# EAGLE design ULA (EAGLE 7.4.0)
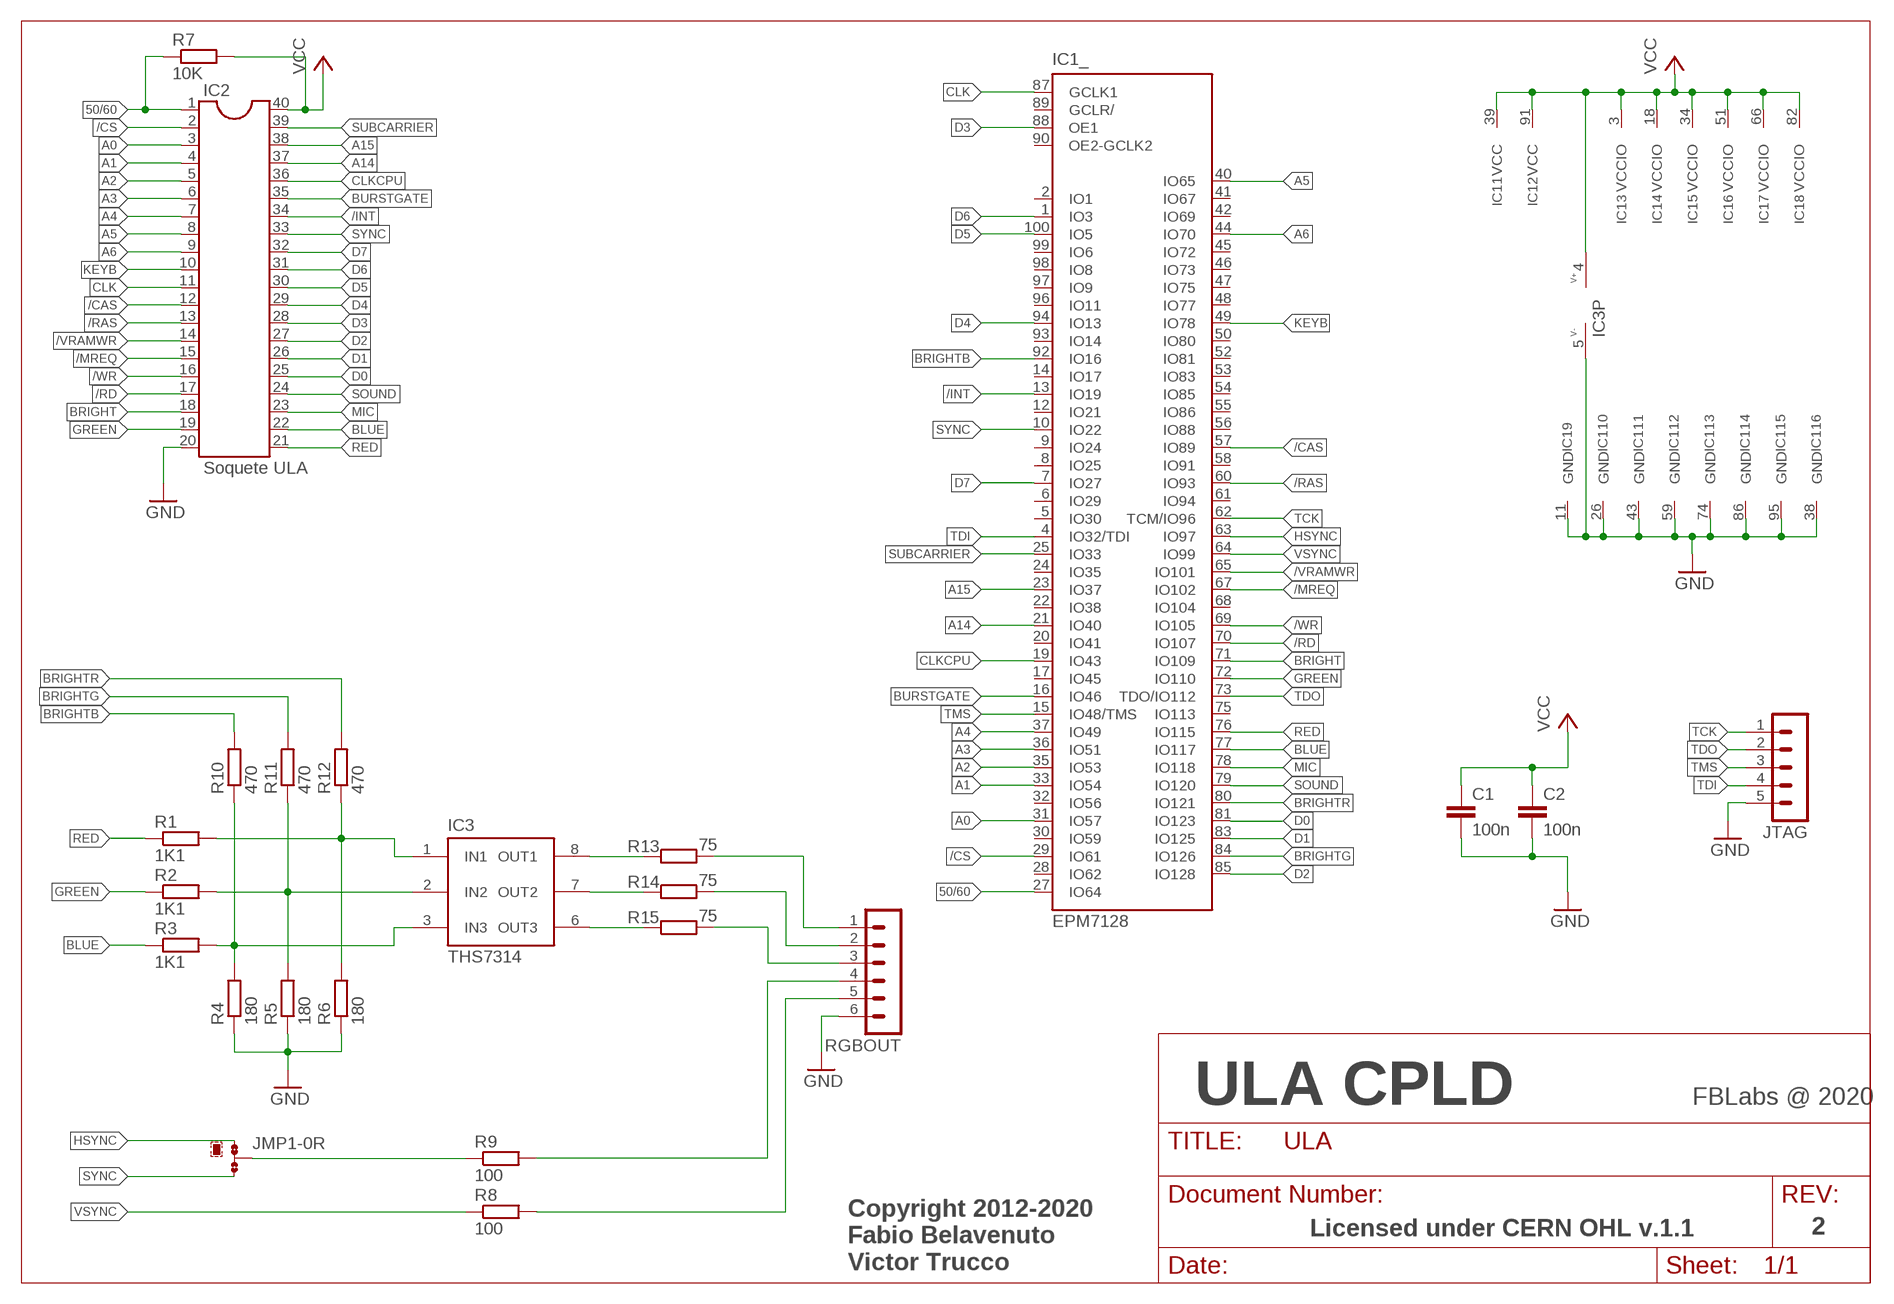
[diagram p0: schematic, sheet 1]

## Parts
C1  100n  C-EUC1206  [C1206]
C2  100n  C-EUC1206  [C1206]
IC1  EPM7128  EPM7128-T100  [TQFP100]
IC2  Soquete ULA  DIL40  [DIL40]
IC3  THS7314  [SOIC8]
JMP1  0R-JUMPA  [A0R-JMP]
JTAG  MA05-1  [MA05-1]
R1  1K1  R-EU_M0805  [M0805]
R2  1K1  R-EU_M0805  [M0805]
R3  1K1  R-EU_M0805  [M0805]
R4  180  R-EU_M0805  [M0805]
R5  180  R-EU_M0805  [M0805]
R6  180  R-EU_M0805  [M0805]
R7  10K  R-EU_M0805  [M0805]
R8  100  R-EU_M0805  [M0805]
R9  100  R-EU_M0805  [M0805]
R10  470  R-EU_M0805  [M0805]
R11  470  R-EU_M0805  [M0805]
R12  470  R-EU_M0805  [M0805]
R13  75  R-EU_M0805  [M0805]
R14  75  R-EU_M0805  [M0805]
R15  75  R-EU_M0805  [M0805]
RGBOUT  MA06-1  [MA06-1]

## Nets
50/60: IC1.27(_:IO64) IC2.1 R7.1
/CAS: IC1.57(_:IO89) IC2.12
/CS: IC1.29(_:IO61) IC2.2
/INT: IC1.13(_:IO19) IC2.34
/MREQ: IC1.67(_:IO102) IC2.15
/RAS: IC1.60(_:IO93) IC2.13
/RD: IC1.70(_:IO107) IC2.17
/VRAMWR: IC1.65(_:IO101) IC2.14
/WR: IC1.69(_:IO105) IC2.16
A0: IC1.31(_:IO57) IC2.3
A1: IC1.33(_:IO54) IC2.4
A2: IC1.35(_:IO53) IC2.5
A3: IC1.36(_:IO51) IC2.6
A4: IC1.37(_:IO49) IC2.7
A5: IC1.40(_:IO65) IC2.8
A6: IC1.44(_:IO70) IC2.9
A14: IC1.21(_:IO40) IC2.37
A15: IC1.23(_:IO37) IC2.38
BLUE: IC1.77(_:IO117) IC2.22 R3.1
BRIGHT: IC1.71(_:IO109) IC2.18
BRIGHTB: IC1.92(_:IO16) R10.2
BRIGHTG: IC1.84(_:IO126) R11.2
BRIGHTR: IC1.80(_:IO121) R12.2
BURSTGATE: IC1.16(_:IO46) IC2.35
CLK: IC1.87(_:GCLK1) IC2.11
CLKCPU: IC1.19(_:IO43) IC2.36
D0: IC1.81(_:IO123) IC2.25
D1: IC1.83(_:IO125) IC2.26
D2: IC1.85(_:IO128) IC2.27
D3: IC1.88(_:OE1) IC2.28
D4: IC1.94(_:IO13) IC2.29
D5: IC1.100(_:IO5) IC2.30
D6: IC1.1(_:IO3) IC2.31
D7: IC1.7(_:IO27) IC2.32
GND [Power]: C1.2 C2.2 IC1.11(9:GND) IC1.26(10:GND) IC1.38(16:GND) IC1.43(11:GND) IC1.59(12:GND) IC1.74(13:GND) IC1.86(14:GND) IC1.95(15:GND) IC2.20 IC3.5(V-) JTAG.5 R4.1 R5.1 R6.1 RGBOUT.6
GREEN: IC1.72(_:IO110) IC2.19 R2.1
HSYNC: IC1.63(_:IO97) JMP1.1
KEYB: IC1.49(_:IO78) IC2.10
MIC: IC1.78(_:IO118) IC2.23
N$1: R15.2 RGBOUT.3
N$2: R14.2 RGBOUT.2
N$3: R13.2 RGBOUT.1
N$4: IC3.3(IN3) R3.2 R4.2 R10.1
N$5: IC3.2(IN2) R2.2 R5.2 R11.1
N$6: IC3.6(OUT3) R15.1
N$7: IC3.7(OUT2) R14.1
N$8: IC3.8(OUT1) R13.1
N$10: IC3.1(IN1) R1.2 R6.2 R12.1
N$12: JMP1.2 R9.1
N$13: R9.2 RGBOUT.4
N$14: R8.2 RGBOUT.5
RED: IC1.76(_:IO115) IC2.21 R1.1
SOUND: IC1.79(_:IO120) IC2.24
SUBCARRIER: IC1.25(_:IO33) IC2.39
SYNC: IC1.10(_:IO22) IC2.33 JMP1.3
TCK: IC1.62(_:TCM/IO96) JTAG.1
TDI: IC1.4(_:IO32/TDI) JTAG.4
TDO: IC1.73(_:TDO/IO112) JTAG.2
TMS: IC1.15(_:IO48/TMS) JTAG.3
VCC [Power]: C1.1 C2.1 IC1.3(3:VCCIO) IC1.18(4:VCCIO) IC1.34(5:VCCIO) IC1.39(1:VCC) IC1.51(6:VCCIO) IC1.66(7:VCCIO) IC1.82(8:VCCIO) IC1.91(2:VCC) IC2.40 IC3.4(V+) R7.2
VSYNC: IC1.64(_:IO99) R8.1
Unconnected: IC1.2(_:IO1) IC1.5(_:IO30) IC1.6(_:IO29) IC1.8(_:IO25) IC1.9(_:IO24) IC1.12(_:IO21) IC1.14(_:IO17) IC1.17(_:IO45) IC1.20(_:IO41) IC1.22(_:IO38) IC1.24(_:IO35) IC1.28(_:IO62) IC1.30(_:IO59) IC1.32(_:IO56) IC1.41(_:IO67) IC1.42(_:IO69) IC1.45(_:IO72) IC1.46(_:IO73) IC1.47(_:IO75) IC1.48(_:IO77) IC1.50(_:IO80) IC1.52(_:IO81) IC1.53(_:IO83) IC1.54(_:IO85) IC1.55(_:IO86) IC1.56(_:IO88) IC1.58(_:IO91) IC1.61(_:IO94) IC1.68(_:IO104) IC1.75(_:IO113) IC1.89(_:GCLR/) IC1.90(_:OE2-GCLK2) IC1.93(_:IO14) IC1.96(_:IO11) IC1.97(_:IO9) IC1.98(_:IO8) IC1.99(_:IO6)

## Notes on the sheet
- ULA CPLD | FBLabs @ 2020
- Licensed under CERN OHL v.1.1 | 2
- Copyright 2012-2020
  Fabio Belavenuto
  Victor Trucco

## Library data of the parts
C1 C2 = rcl:C-EU: CAPACITOR, European symbol
IC1 = altera2:EPM7128-?100: EPM70128 MAX 7000 family; MPN: EPM7128STC100-7N; OC_FARNELL: 1549427; OC_NEWARK: 51R9778
IC2 = ULA_libs:DIL40: Dual In Line
IC3 = Texas2:THS7314: THS7314DR Video Buffer
JMP1 = jump-0r-smd:0R-JUMP: SMD 0R 0805 Jumper
JTAG = ULA_libs:MA05-1: PIN HEADER
R1-R15 = rcl:R-EU_: RESISTOR, European symbol
RGBOUT = ULA_libs:MA06-1: PIN HEADER

## Net classes
0 default: width 0.152 mm, drill 0.483 mm, clearance 0.152 mm
1 Power: width 0.203 mm, drill 0.584 mm, clearance 0.203 mm

## Board
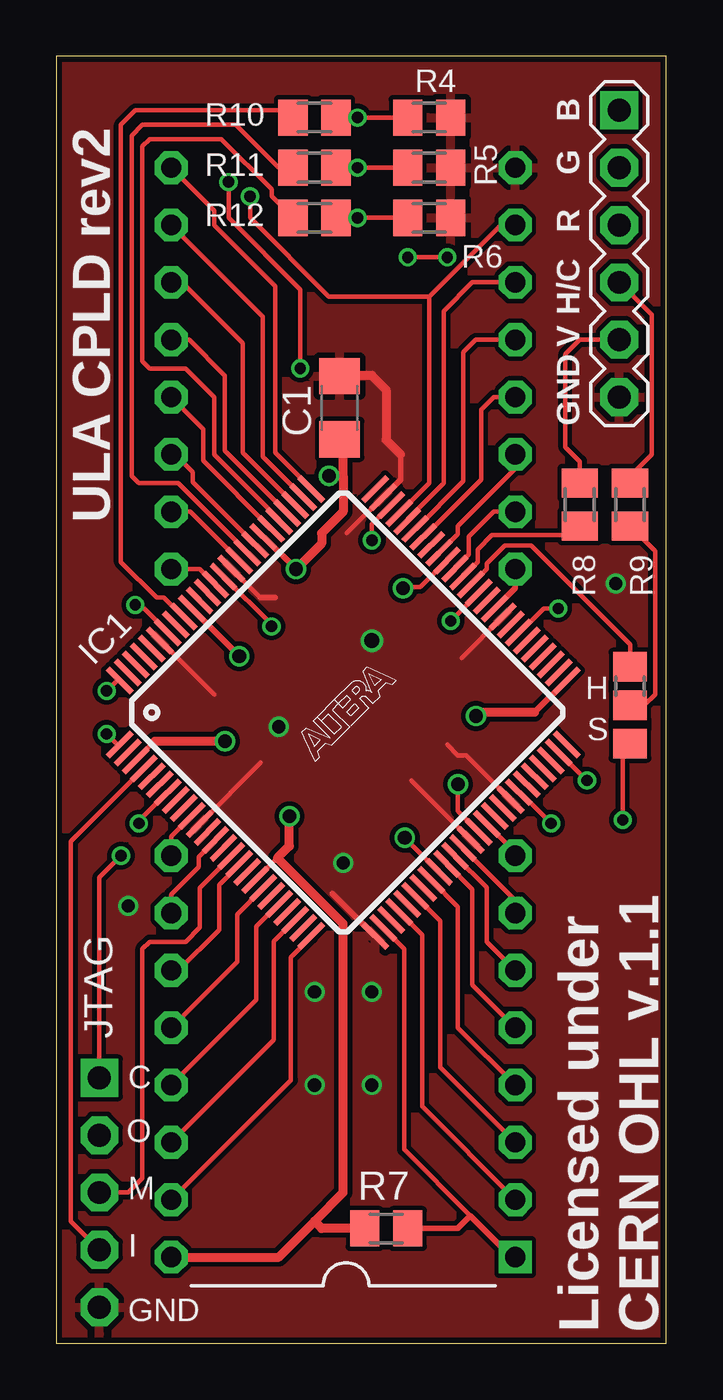
[diagram p1: board, top side]
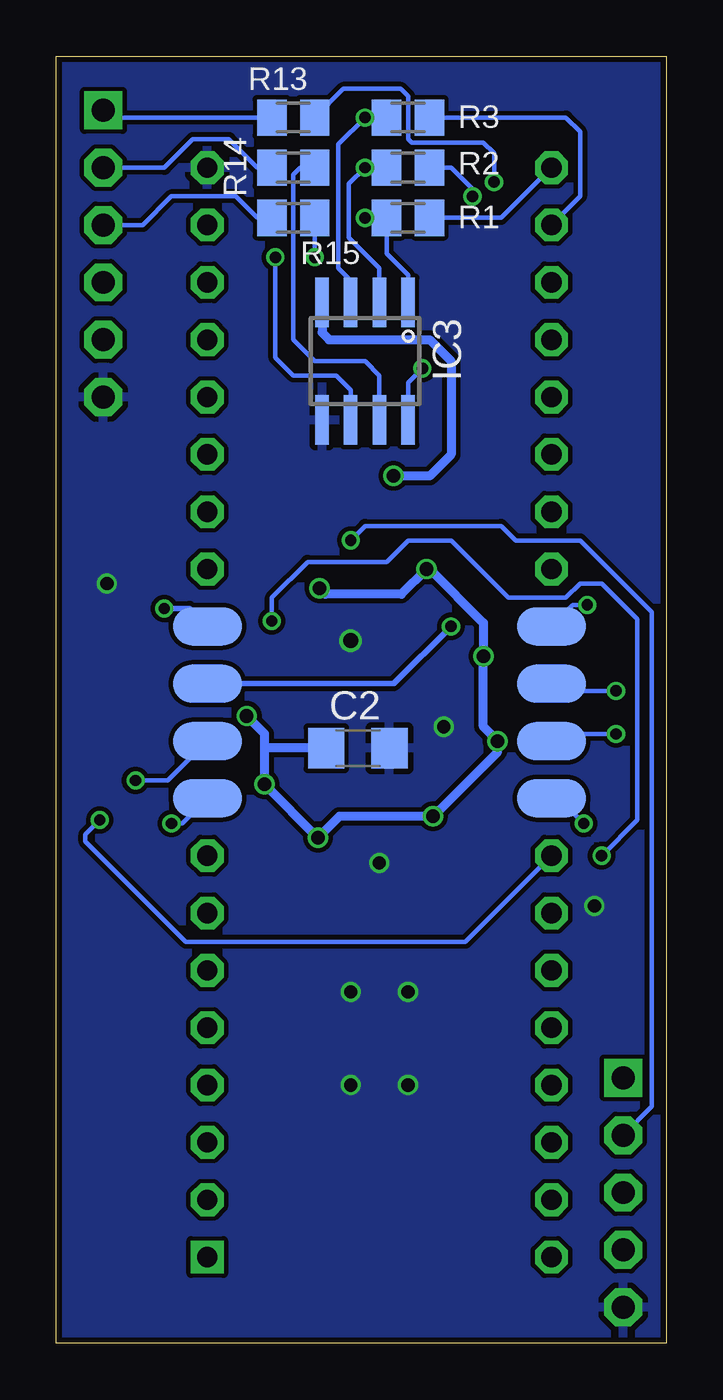
[diagram p2: board, bottom side, seen from below]

Size 27 x 57 mm. Coordinates in mm from the lower left corner, seen from the top.
Outline: 0,0 27,0 27,57 0,57 0,0
Copper layers (1*16): Top 0.035mm / dielectric 1.5mm / Bottom 0.035mm
Design rules "Seedstudio(6mil) *": minimum track width 6mil, minimum drill 12mil, track to track 6mil, track to pad 6mil, pad to pad 6mil, via to via 6mil, smd to smd 0mil, copper to edge 10mil, drill to drill 10mil, minimum pad ring 10mil, minimum via ring 6mil, stop-mask expansion 2mil, vias tented up to drill 100mil, thermal gap 10mil

### Footprints (pad centres in the part's own frame; a part is rotated, then mirrored left to right if it is on the bottom)
C1206 = smd 1.6 x 1.8: 1 -1.4,0; 2 1.4,0
TQFP100 = smd 1.5 x 0.25: 1 -8,6; 2 -8,5.5; 3 -8,5; 4 -8,4.5; 5 -8,4; 6 -8,3.5; 7 -8,3; 8 -8,2.5; 9 -8,2; 10 -8,1.5; 11 -8,1; 12 -8,0.5; 13 -8,0; 14 -8,-0.5; 15 -8,-1; 16 -8,-1.5; 17 -8,-2; 18 -8,-2.5; 19 -8,-3; 20 -8,-3.5; 21 -8,-4; 22 -8,-4.5; 23 -8,-5; 24 -8,-5.5; 25 -8,-6; 51 8,-6; 52 8,-5.5; 53 8,-5; 54 8,-4.5; 55 8,-4; 56 8,-3.5; 57 8,-3; 58 8,-2.5; 59 8,-2; 60 8,-1.5; 61 8,-1; 62 8,-0.5; 63 8,0; 64 8,0.5; 65 8,1; 66 8,1.5; 67 8,2; 68 8,2.5; 69 8,3; 70 8,3.5; 71 8,4; 72 8,4.5; 73 8,5; 74 8,5.5; 75 8,6 | smd 0.25 x 1.5: 26 -6,-8; 27 -5.5,-8; 28 -5,-8; 29 -4.5,-8; 30 -4,-8; 31 -3.5,-8; 32 -3,-8; 33 -2.5,-8; 34 -2,-8; 35 -1.5,-8; 36 -1,-8; 37 -0.5,-8; 38 0,-8; 39 0.5,-8; 40 1,-8; 41 1.5,-8; 42 2,-8; 43 2.5,-8; 44 3,-8; 45 3.5,-8; 46 4,-8; 47 4.5,-8; 48 5,-8; 49 5.5,-8; 50 6,-8; 76 6,8; 77 5.5,8; 78 5,8; 79 4.5,8; 80 4,8; 81 3.5,8; 82 3,8; 83 2.5,8; 84 2,8; 85 1.5,8; 86 1,8; 87 0.5,8; 88 0,8; 89 -0.5,8; 90 -1,8; 91 -1.5,8; 92 -2,8; 93 -2.5,8; 94 -3,8; 95 -3.5,8; 96 -4,8; 97 -4.5,8; 98 -5,8; 99 -5.5,8; 100 -6,8
DIL40 = drill 0.9 pad 1.448 square: 1 -24.13,-7.62 | drill 0.9 pad 1.448 octagon: 2 -21.59,-7.62; 3 -19.05,-7.62; 4 -16.51,-7.62; 5 -13.97,-7.62; 6 -11.43,-7.62; 7 -8.89,-7.62; 8 -6.35,-7.62; 13 6.35,-7.62; 14 8.89,-7.62; 15 11.43,-7.62; 16 13.97,-7.62; 17 16.51,-7.62; 18 19.05,-7.62; 19 21.59,-7.62; 20 24.13,-7.62; 21 24.13,7.62; 22 21.59,7.62; 23 19.05,7.62; 24 16.51,7.62; 25 13.97,7.62; 26 11.43,7.62; 27 8.89,7.62; 28 6.35,7.62; 33 -6.35,7.62; 34 -8.89,7.62; 35 -11.43,7.62; 36 -13.97,7.62; 37 -16.51,7.62; 38 -19.05,7.62; 39 -21.59,7.62; 40 -24.13,7.62 | smd 1.676 x 3.048 bottom: 9 -3.81,-7.62; 10 -1.27,-7.62; 11 1.27,-7.62; 12 3.81,-7.62; 29 3.81,7.62; 30 1.27,7.62; 31 -1.27,7.62; 32 -3.81,7.62
SOIC8 = smd 0.6 x 2.2: 1 -1.905,-2.6; 2 -0.635,-2.6; 3 0.635,-2.6; 4 1.905,-2.6; 5 1.905,2.6; 6 0.635,2.6; 7 -0.635,2.6; 8 -1.905,2.6
A0R-JMP = smd 1.5 x 1.3: 1 0,1.7; 2 0,0; 3 0,-1.7
MA05-1 = drill 1.016 pad 1.676 square: 1 -5.08,0 | drill 1.016 pad 1.676 octagon: 2 -2.54,0; 3 0,0; 4 2.54,0; 5 5.08,0
M0805 = smd 1.3 x 1.6: 1 -0.95,0; 2 0.95,0
MA06-1 = drill 1.016 pad 1.676 square: 1 -6.35,0 | drill 1.016 pad 1.676 octagon: 2 -3.81,0; 3 -1.27,0; 4 1.27,0; 5 3.81,0; 6 6.35,0

### Placement (x,y rotation side)
C1  12.54,41.43 90 top
C2  13.65,26.35 0 bottom
IC1  12.7,27.94 45 top
IC2  12.7,27.94 90 top
IC3  13.34,43.5 180 bottom
JMP1  25.4,28.26 0 top
JTAG  1.91,6.67 270 top
R1  11.43,49.85 180 bottom
R2  11.43,52.07 180 bottom
R3  11.43,54.29 180 bottom
R4  16.51,54.29 180 top
R5  16.51,52.07 180 top
R6  16.51,49.85 180 top
R7  14.61,5.08 180 top
R8  23.18,37.15 90 top
R9  25.4,37.15 90 top
R10  11.43,54.29 180 top
R11  11.43,52.07 180 top
R12  11.43,49.85 180 top
R13  16.51,54.29 180 bottom
R14  16.51,52.07 180 bottom
R15  16.51,49.85 180 bottom
RGBOUT  24.92,48.26 270 top

### Tracks (layer width: path | path; a pad name or v marks a point on that pad's centre or on a via)
50/60
  Top 0.203: 18.34,5.64 15.4,8.57 15.4,17.45 IC1.27
  Top 0.254: IC2.1 20.16,3.81 18.34,5.64 17.78,5.08 R7.1
/CAS  (via drill 0.5)
  Top 0.203: IC1.57 20.52,31.48 21.59,32.54 v22.23,32.54
  Bottom 0.254: v22.23,32.54 21.11,32.54 IC2.12
/CS
  Top 0.203: IC2.2 16.19,10.48 16.19,18.08 IC1.29
/INT
  Top 0.203: IC2.34 5.08,19.88 6.3,21.1 6.3,21.54 IC1.13
/MREQ
  Top 0.203: IC1.67 17.78,35.85 17.78,36.2 20.32,38.73 IC2.15
/RAS
  Top 0.254: IC2.13 20.32,33.44 IC1.60
/RD
  Top 0.203: IC2.17 18.57,44.45 18.02,43.89 18.02,38.18 15.91,36.07 IC1.70
/VRAMWR
  Top 0.203: IC2.14 19.37,36.83 18.26,35.72 18.26,34.92 17.65,34.32 IC1.65
/WR
  Top 0.203: IC2.16 19.37,41.91 18.81,41.35 18.81,38.26 16.27,35.72 IC1.69
A0
  Top 0.203: IC2.3 16.99,12.22 16.99,18.7 IC1.31
A1
  Top 0.203: IC2.4 17.78,13.97 17.78,19.32 IC1.33
A2
  Top 0.203: IC2.5 18.41,15.88 18.41,20.1
  Top 0.208: 18.41,20.1 IC1.35
A3
  Top 0.203: IC2.6 19.05,17.78 19.05,20.18 IC1.36
A4
  Top 0.203: 20.32,19.61 IC1.37
  Top 0.254: IC2.7 20.32,19.61
A5
  Top 0.208: IC2.8 20.32,21.73 IC1.40
A6  (via drill 0.5)
  Top 0.203: IC1.44 20.52,24.4 v21.91,23.02
  Bottom 0.203: v21.91,23.02 21.43,23.02 IC2.9
A14
  Top 0.203: 9.86,19.45 8.86,18.46 8.86,15.21 IC2.37
  Top 0.208: 9.86,19.45 IC1.21
A15
  Top 0.203: IC2.38 9.62,13.43 9.62,17.79 IC1.23
BLUE
  Top 0.203: IC1.77 9.14,39.28 9.14,45.47 IC2.22
  Top 0.208: IC1.77
  Bottom 0.203: R3.1 4.45,54.29 3.81,53.66 3.81,50.8 IC2.22
BRIGHT
  Top 0.203: IC2.18 18.41,46.99 17.14,45.72 17.14,38.1 15.53,36.48 IC1.71
BRIGHTB
  Top 0.203: IC1.92 5.6,32.18 4.76,33.02 4.45,33.02 2.86,34.61 2.86,53.98 3.49,54.61 10.16,54.61 R10.2
BRIGHTG
  Top 0.203: IC1.84 8.46,35.04 5.4,38.1 3.65,38.1 3.33,38.42 3.33,53.5 3.81,53.98 7.94,53.98 9.84,52.07 R11.2
BRIGHTR
  Top 0.203: IC1.80 9.87,36.48 6.99,39.37 6.99,41.91 5.71,43.18 4.13,43.18 3.81,43.5 3.81,53.02 4.13,53.34 7.3,53.34 9.53,51.12 9.53,50.8 R12.2
BURSTGATE
  Top 0.203: IC2.35 5.4,16.51 7.2,18.31 7.2,20.3 8.1,21.2
  Top 0.208: 8.1,21.2 IC1.16
CLK  (via drill 0.5)
  Top 0.208: 9.53,31.82 IC1.87
  Top 0.254: v9.53,31.75 9.53,31.82
  Bottom 0.254: IC2.11 12.06,29.21 v9.53,31.75
CLKCPU
  Top 0.203: IC2.36 8,16.89 8,19 IC1.19
  Top 0.208: IC1.19
D0
  Top 0.203: IC2.25 6.5,40.49 6.5,39.09 IC1.81
D1
  Top 0.203: IC1.83 6.03,38.14 6.03,38.58 5.24,39.37 IC2.26
D2
  Top 0.203: IC1.85 5.93,36.83 IC2.27
D3
  Top 0.203: IC1.88 6.35,34.29 IC2.28
D4  (via drill 0.5)
  Top 0.203: IC1.94 4.92,31.51 3.89,32.54 3.65,32.54 v3.49,32.7
  Bottom 0.203: v3.49,32.7 4.13,32.7 IC2.29
  Bottom 0.208: 4.92,31.91 IC2.29
D5  (via drill 0.5)
  Top 0.203: 2.68,29.35 v2.22,28.89
  Top 0.254: IC1.100 2.68,29.35
  Bottom 0.203: v2.22,28.89 4.76,28.89 IC2.30
D6  (via drill 0.5)
  Top 0.203: IC1.1 2.68,26.53 v2.22,26.99
  Bottom 0.203: v2.22,26.99 4.76,26.99 IC2.31
D7  (via drill 0.5)
  Top 0.203: v3.65,23.02 3.65,23.13 IC1.7
  Bottom 0.203: 4.76,24.13 v3.65,23.02
  Bottom 0.254: IC2.32 4.76,24.13
GND  (via drill 0.58 pad 0.25, 0.66)
  Top 0.203: 12.86,35.88 IC1.74 | IC1.95 4.6,31.12 6.99,28.73
  Top 0.208: 9.05,25.72 6.34,23 IC1.11 | IC1.86 9.03,33.02 | IC1.74 | IC1.59 17.94,30.35 | IC1.43 18.14,26.04 17.78,26.04 17.3,26.51 | 15.72,24.92 IC1.38
  Top 0.254: 9.68,33.02 9.03,33.02 | 15.24,39.37 15.24,38.26 IC1.74 | IC1.26 12.22,19.92
  Top 0.406: 15.24,39.37 14.61,40.01 14.61,42.23 13.97,42.86 12.57,42.86 C1.2
  other vias: 9.84,27.3 13.97,31.11 11.43,15.56 13.97,15.56 13.97,11.43 11.43,11.43 24.77,33.66 12.7,21.27 3.17,19.37
  pour Top: -1,58 -1,-1 28,-1 28,58
  pour Bottom: -1.48,58.48 28.48,58.63 28.48,-1.48 -1.48,-1.64
GREEN  (via drill 0.5)
  Top 0.203: 15.19,36.78 16.51,38.1 16.51,46.35 | v8.57,50.8 8.57,49.85 12.06,46.35 16.51,46.35 | 16.51,46.35 19.68,49.53 IC2.19
  Top 0.208: IC1.72 15.19,36.78
  Bottom 0.203: R2.1 9.53,52.07 8.57,51.12 v8.57,50.8
HSYNC
  Top 0.203: IC1.63 19.05,34.29 19.05,34.53 19.84,35.32 21.03,35.32 25.4,30.96 JMP1.1
KEYB  (via drill 0.5)
  Top 0.203: IC1.49 v23.5,24.92
  Top 0.208: IC1.49
  Bottom 0.203: v23.5,24.92 22.07,24.92 IC2.10
MIC
  Top 0.203: IC1.78 8.26,39.46 8.26,44.29 5.56,46.99 IC2.23
N$1
  Bottom 0.203: R15.2 18.1,49.85 19.05,50.8 21.91,50.8 23.18,49.53 RGBOUT.3
N$2
  Bottom 0.203: R14.2 18.1,52.07 19.37,53.34 20.95,53.34 22.23,52.07 RGBOUT.2
N$3
  Bottom 0.203: R13.2 24.61,54.29 RGBOUT.1
N$4  (via drill 0.5)
  Top 0.203: R10.1 v13.34,54.29 R4.2
  Bottom 0.203: IC3.3 13.97,47.07 14.53,47.62 14.53,53.1 v13.34,54.29 R10.1
N$5  (via drill 0.5)
  Top 0.203: R11.1 v13.34,52.07 R5.2
  Bottom 0.203: IC3.2 12.7,47.62 14.05,48.97 14.05,51.36 v13.34,52.07 R11.1
N$6  (via drill 0.5)
  Top 0.203: v17.3,48.1 v15.56,48.1
  Bottom 0.203: IC3.6 13.97,42.23 14.61,42.86 16.51,42.86 17.3,43.66 v17.3,48.1 | v15.56,48.1 R15.1
N$7
  Bottom 0.203: IC3.7 12.7,42.86 13.34,43.5 15.56,43.5 16.51,44.45 16.51,51.75 16.19,52.07 R14.1
N$8  (via drill 0.5)
  Top 0.203: v10.79,43.18 10.79,46.67 7.62,49.85 v7.62,51.44
  Bottom 0.203: IC3.8 11.43,42.55 v10.79,43.18 | R13.1 14.29,55.56 11.75,55.56 11.43,55.24 11.43,53.34 11.27,53.18 8.1,53.18 7.62,52.7 v7.62,51.44
N$10  (via drill 0.5)
  Top 0.203: R12.1 v13.34,49.85 R6.2
  Bottom 0.203: v13.34,49.85 R12.1 12.38,48.26 11.43,47.31 IC3.1
N$12
  Top 0.203: JMP1.2 26.04,28.26 26.51,28.73 26.51,35.09 R9.1
N$13
  Top 0.203: R9.2 25.4,38.42 26.35,39.37 26.35,45.56 RGBOUT.4
N$14
  Top 0.203: R8.2 23.18,39.05 22.54,39.69 22.54,43.81 23.18,44.45 RGBOUT.5
RED
  Top 0.203: IC2.21 6.99,50.16 6.99,49.53 9.7,46.81 9.7,39.45 11.29,37.87 IC1.76
  Bottom 0.203: R1.1 7.3,49.85 IC2.21
SOUND
  Top 0.203: IC1.79 7.46,39.54 7.46,42.86 5.87,44.45 IC2.24
SUBCARRIER
  Top 0.203: IC2.39 10.38,11.65 10.38,17.08 11.29,17.99
  Top 0.208: 11.29,17.99 IC1.25
SYNC  (via drill 0.5)
  Top 0.203: IC2.33 5.08,22.44 IC1.10 | v25.08,23.18 25.08,26.24 JMP1.3
  Bottom 0.203: v25.08,23.18 25.72,22.54 25.72,22.23 21.27,17.78 8.89,17.78 IC2.33
TCK  (via drill 0.5)
  Top 0.203: JTAG.1 1.91,20.64 v2.86,21.59 | IC1.62 v17.46,31.99
  Bottom 0.203: v17.46,31.99 17.46,33.02 15.88,34.61 12.38,34.61 11.43,35.56 9.53,35.56 6.99,33.02 4.45,33.02 3.81,33.66 2.86,33.66 1.27,32.07 1.27,23.18 v2.86,21.59
TDI
  Top 0.203: 3.86,25.45 0.64,22.23 0.64,5.4 JTAG.4
  Top 0.254: IC1.4 3.86,25.45
TDO  (via drill 0.5)
  Top 0.203: IC1.73 13.97,36.27 v13.97,35.56
  Top 0.254: IC1.73
  Bottom 0.203: v13.97,35.56 13.34,36.2 7.3,36.2 6.67,35.56 3.81,35.56 0.64,32.38 0.64,10.48 JTAG.2
TMS
  Top 0.203: JTAG.3 3.17,6.67 3.81,7.3 3.81,17.46 4.13,17.78 5.71,17.78 6.35,18.41 6.35,20.16 7.75,21.56
  Top 0.254: IC1.15 7.75,21.56
VCC  (via drill 0.6)
  Top 0.203: v15.35,33.45 15.4,33.5 16.11,33.5 17.27,34.66 IC1.66
  Top 0.208: IC1.18 8.86,20.56 9.79,21.48 | IC1.3 4.36,26.67 | IC1.39 17.78,23.57 v17.78,24.77 | v15.42,22.38 16.91,20.89 IC1.34 | IC1.51 22.53,29.28
  Top 0.254: v8.1,30.43 6.19,32.33 IC1.91 | 22.53,29.28 21.16,27.94 | IC1.82 9.18,35.72 v10.61,34.29
  Top 0.406: 4.36,26.67 v7.46,26.67 | v10.32,23.34 10.32,22.02 9.79,21.48 12.69,18.57 12.7,18.57 12.7,6.67 11.43,5.4 | 21.16,27.94 18.73,27.94 v18.57,27.78 | 12.7,38.42 12.7,36.83 11.75,35.88 11.75,35.43 v10.61,34.29 | IC2.40 9.84,3.81 11.43,5.4 | R7.2 11.75,5.08 11.43,5.4 | v12.06,38.42 12.7,38.42 | 12.7,38.42 12.7,39.88 C1.1
  Bottom 0.406: 17.78,26.35 v17.78,24.77 17.78,24.74 v15.42,22.38 14.47,23.34 v10.32,23.34 7.46,26.19 v7.46,26.67 8.1,27.3 v8.1,30.43 8.1,31.91 10.48,34.29 v10.61,34.29 11.72,33.18 15.08,33.18 v15.35,33.45 | C2.1 17.78,26.35 | IC3.4 15.24,44.77 14.92,44.45 10.48,44.45 9.53,43.5 9.53,39.37 10.48,38.42 v12.06,38.42 | 17.78,26.35 17.78,26.99 v18.57,27.78
VSYNC
  Top 0.203: IC1.64 18.65,34.61 18.65,35.16 19.29,35.8 22.78,35.8 R8.1

### Text on the board
tPlace: B | G | R | H/C | V | GND | ULA CPLD rev2 | H | S | C | O | M | I | GND | Licensed under / CERN OHL v.1.1